# Altium schematic sheet REMOTE-1.SchDoc
size A3; PageSetup: Record=PageOptions|CenterHorizontal=True|CenterVertical=True|PrintScale=1.00|XCorrection=1.00|YCorrection=1.00|PrintKind=1|BorderSize=5000000|LeftOffset=0|BottomOffset=0|Orientation=2|PaperLength=1000|PaperWidth=1000|Scale=100|PaperSource=7|PrintQuality=-4|MediaType=1|DitherType=10|PaperKind=A3|PrintScaleMode=1
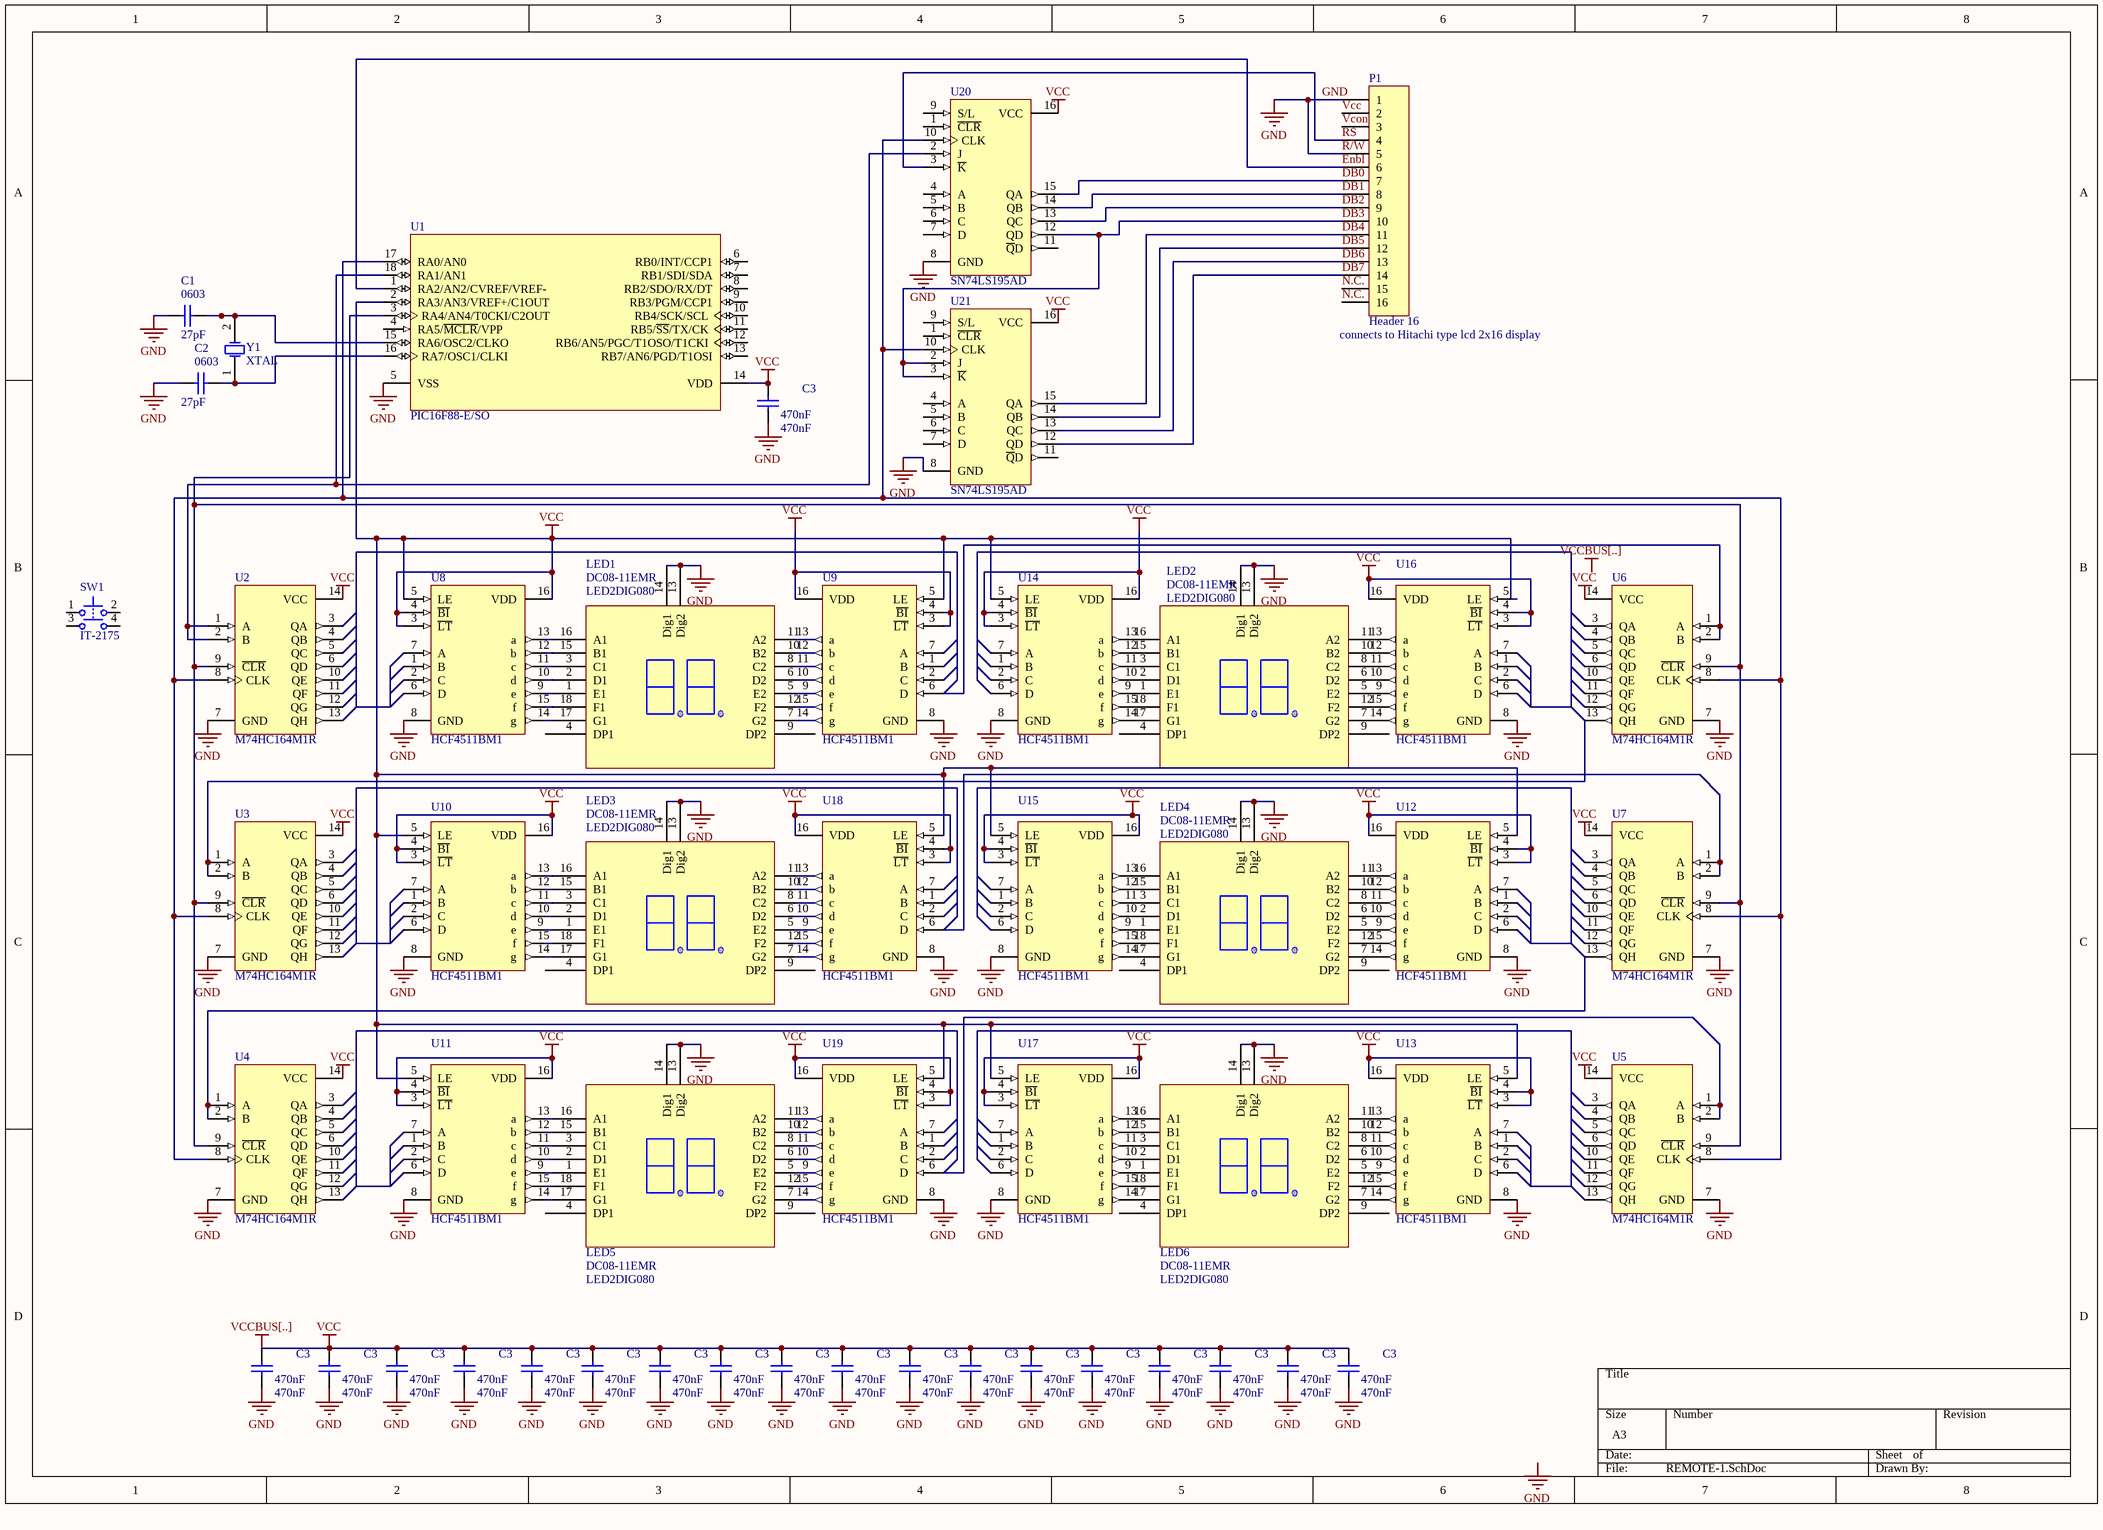
[diagram p0: REMOTE-1.SchDoc]

## Parts
(Parts that share a designator on the sheet are numbered #1, #2 ... from top to bottom, then left to right.)
C1  27pF  [0603]
C2  value 27pF  [0603]  (hidden comment: 0603)
C3#1  470nF  [0603]
C3#2  470nF  [0603]
C3#3  470nF  [0603]
C3#4  470nF  [0603]
C3#5  470nF  [0603]
C3#6  470nF  [0603]
C3#7  470nF  [0603]
C3#8  470nF  [0603]
C3#9  470nF  [0603]
C3#10  470nF  [0603]
C3#11  470nF  [0603]
C3#12  470nF  [0603]
C3#13  470nF  [0603]
C3#14  470nF  [0603]
C3#15  470nF  [0603]
C3#16  470nF  [0603]
C3#17  470nF  [0603]
C3#18  470nF  [0603]
C3#19  470nF  [0603]
LED1  DC08-11EMR  Footprint: LED2DIG080  [LED2DIG-DIP18]
LED2  DC08-11EMR  Footprint: LED2DIG080  [LED2DIG-DIP18]
LED3  DC08-11EMR  Footprint: LED2DIG080  [LED2DIG-DIP18]
LED4  DC08-11EMR  Footprint: LED2DIG080  [LED2DIG-DIP18]
LED5  DC08-11EMR  Footprint: LED2DIG080  [LED2DIG-DIP18]
LED6  DC08-11EMR  Footprint: LED2DIG080  [LED2DIG-DIP18]
P1  Header 16  [HDR1X16]
SW1  IT-2175  [IT-2175]
U1  PIC16F88-E/SO  [SOIC300-18_N]
U2  M74HC164M1R  [SO14_N]
U3  M74HC164M1R  [SO14_N]
U4  M74HC164M1R  [SO14_N]
U5  M74HC164M1R  [SO14_N]
U6  M74HC164M1R  [SO14_N]
U7  M74HC164M1R  [SO14_N]
U8  HCF4511BM1  [SO16_L]
U9  HCF4511BM1  [SO16_L]
U10  HCF4511BM1  [SO16_L]
U11  HCF4511BM1  [SO16_L]
U12  HCF4511BM1  [SO16_L]
U13  HCF4511BM1  [SO16_L]
U14  HCF4511BM1  [SO16_L]
U15  HCF4511BM1  [SO16_L]
U16  HCF4511BM1  [SO16_L]
U17  HCF4511BM1  [SO16_L]
U18  HCF4511BM1  [SO16_L]
U19  HCF4511BM1  [SO16_L]
U20  SN74LS195AD  [D016_L]
U21  SN74LS195AD  [D016_L]
Y1  XTAL  [R38]

## Nets
GND: C1.1 C2.1 C3#1.2 C3#2.2 C3#3.2 C3#4.2 C3#5.2 C3#6.2 C3#7.2 C3#8.2 C3#9.2 C3#10.2 C3#11.2 C3#12.2 C3#13.2 C3#14.2 C3#15.2 C3#16.2 C3#17.2 C3#18.2 C3#19.2 LED1.13(Dig2) LED1.14(Dig1) LED2.13(Dig2) LED2.14(Dig1) LED3.13(Dig2) LED3.14(Dig1) LED4.13(Dig2) LED4.14(Dig1) LED5.13(Dig2) LED5.14(Dig1) LED6.13(Dig2) LED6.14(Dig1) P1.1 P1.5 U1.5(VSS) U2.7(GND) U3.7(GND) U4.7(GND) U5.7(GND) U6.7(GND) U7.7(GND) U8.8(GND) U9.8(GND) U10.8(GND) U11.8(GND) U12.8(GND) U13.8(GND) U14.8(GND) U15.8(GND) U16.8(GND) U17.8(GND) U18.8(GND) U19.8(GND) U20.8(GND) U21.8(GND)  [also labelled R~{/}W]
Vcc: C3#1.1 C3#2.1 C3#3.1 C3#4.1 C3#5.1 C3#6.1 C3#7.1 C3#8.1 C3#9.1 C3#10.1 C3#11.1 C3#12.1 C3#13.1 C3#14.1 C3#15.1 C3#16.1 C3#17.1 C3#18.1 C3#19.1 P1.2 U1.2(RA3/AN3/VREF+/C1OUT) U1.14(VDD) U2.14(VCC) U3.14(VCC) U4.14(VCC) U5.14(VCC) U6.14(VCC) U7.14(VCC) U8.3(~{LT}) U8.4(~{BI}) U8.5(LE) U8.16(VDD) U9.3(~{LT}) U9.4(~{BI}) U9.5(LE) U9.16(VDD) U10.3(~{LT}) U10.4(~{BI}) U10.5(LE) U10.16(VDD) U11.3(~{LT}) U11.4(~{BI}) U11.5(LE) U11.16(VDD) U12.3(~{LT}) U12.4(~{BI}) U12.5(LE) U12.16(VDD) U13.3(~{LT}) U13.4(~{BI}) U13.5(LE) U13.16(VDD) U14.3(~{LT}) U14.4(~{BI}) U14.5(LE) U14.16(VDD) U15.3(~{LT}) U15.4(~{BI}) U15.5(LE) U15.16(VDD) U16.3(~{LT}) U16.4(~{BI}) U16.5(LE) U16.16(VDD) U17.3(~{LT}) U17.4(~{BI}) U17.5(LE) U17.16(VDD) U18.3(~{LT}) U18.4(~{BI}) U18.5(LE) U18.16(VDD) U19.3(~{LT}) U19.4(~{BI}) U19.5(LE) U19.16(VDD) U20.16(VCC) U21.16(VCC)  [also labelled VCCBUS[..]]
DB0: P1.7 U20.15(QA)
DB1: P1.8 U20.14(QB)
DB2: P1.9 U20.13(QC)
DB3: P1.10 U20.12(QD) U21.2(J) U21.3(~{K})
DB4: P1.11 U21.15(QA)
DB5: P1.12 U21.14(QB)
DB6: P1.13 U21.13(QC)
DB7: P1.14 U21.12(QD)
Enbl: P1.6 U1.1(RA2/AN2/CVREF/VREF-)
N.C.: P1.15 P1.16
RS: P1.4 U20.3(~{K})
Vcon: P1.3
NetC1_2: C1.2 U1.15(RA6/OSC2/CLKO) Y1.2(OSC2)
NetC2_2: C2.2 U1.16(RA7/OSC1/CLKI) Y1.1(OSC1)
NetLED1_1: LED1.1(E1) U8.9(e)
NetLED1_2: LED1.2(D1) U8.10(d)
NetLED1_3: LED1.3(C1) U8.11(c)
NetLED1_5: LED1.5(E2) U9.9(e)
NetLED1_6: LED1.6(D2) U9.10(d)
NetLED1_7: LED1.7(G2) U9.14(g)
NetLED1_8: LED1.8(C2) U9.11(c)
NetLED1_10: LED1.10(B2) U9.12(b)
NetLED1_11: LED1.11(A2) U9.13(a)
NetLED1_12: LED1.12(F2) U9.15(f)
NetLED1_15: LED1.15(B1) U8.12(b)
NetLED1_16: LED1.16(A1) U8.13(a)
NetLED1_17: LED1.17(G1) U8.14(g)
NetLED1_18: LED1.18(F1) U8.15(f)
NetLED3_1: LED3.1(E1) U10.9(e)
NetLED3_2: LED3.2(D1) U10.10(d)
NetLED3_3: LED3.3(C1) U10.11(c)
NetLED3_5: LED3.5(E2) U18.9(e)
NetLED3_6: LED3.6(D2) U18.10(d)
NetLED3_7: LED3.7(G2) U18.14(g)
NetLED3_8: LED3.8(C2) U18.11(c)
NetLED3_10: LED3.10(B2) U18.12(b)
NetLED3_11: LED3.11(A2) U18.13(a)
NetLED3_12: LED3.12(F2) U18.15(f)
NetLED3_15: LED3.15(B1) U10.12(b)
NetLED3_16: LED3.16(A1) U10.13(a)
NetLED3_17: LED3.17(G1) U10.14(g)
NetLED3_18: LED3.18(F1) U10.15(f)
NetLED5_1: LED5.1(E1) U11.9(e)
NetLED5_2: LED5.2(D1) U11.10(d)
NetLED5_3: LED5.3(C1) U11.11(c)
NetLED5_5: LED5.5(E2) U19.9(e)
NetLED5_6: LED5.6(D2) U19.10(d)
NetLED5_7: LED5.7(G2) U19.14(g)
NetLED5_8: LED5.8(C2) U19.11(c)
NetLED5_10: LED5.10(B2) U19.12(b)
NetLED5_11: LED5.11(A2) U19.13(a)
NetLED5_12: LED5.12(F2) U19.15(f)
NetLED5_15: LED5.15(B1) U11.12(b)
NetLED5_16: LED5.16(A1) U11.13(a)
NetLED5_17: LED5.17(G1) U11.14(g)
NetLED5_18: LED5.18(F1) U11.15(f)
NetU1_3: U1.3(RA4/AN4/T0CKI/C2OUT) U2.9(~{CLR}) U3.9(~{CLR}) U4.9(~{CLR}) U5.9(~{CLR}) U6.9(~{CLR}) U7.9(~{CLR})
NetU1_17: U1.17(RA0/AN0) U2.8(CLK) U3.8(CLK) U4.8(CLK) U5.8(CLK) U6.8(CLK) U7.8(CLK) U20.10(CLK) U21.10(CLK)
NetU1_18: U1.18(RA1/AN1) U2.1(A) U2.2(B) U20.2(J)
NetU3_1: U3.1(A) U3.2(B) U6.13(QH)
NetU4_1: U4.1(A) U4.2(B) U7.13(QH)
NetU5_1: U5.1(A) U5.2(B) U19.6(D)
NetU6_1: U6.1(A) U6.2(B) U9.6(D)
NetU7_1: U7.1(A) U7.2(B) U18.6(D)

Not connected (* = marked no-connect by the designer): LED1 4(DP1) 9(DP2); LED2 1(E1) 2(D1) 3(C1) 4(DP1) 5(E2) 6(D2) 7(G2) 8(C2) 9(DP2) 10(B2) 11(A2) 12(F2) 15(B1) 16(A1) 17(G1) 18(F1); LED3 4(DP1) 9(DP2); LED4 1(E1) 2(D1) 3(C1) 4(DP1) 5(E2) 6(D2) 7(G2) 8(C2) 9(DP2) 10(B2) 11(A2) 12(F2) 15(B1) 16(A1) 17(G1) 18(F1); LED5 4(DP1) 9(DP2); LED6 1(E1) 2(D1) 3(C1) 4(DP1) 5(E2) 6(D2) 7(G2) 8(C2) 9(DP2) 10(B2) 11(A2) 12(F2) 15(B1) 16(A1) 17(G1) 18(F1); SW1 1 2 3 4; U1 4(RA5/~{MCLR}/VPP) 6(RB0/INT/CCP1) 7(RB1/SDI/SDA) 8(RB2/SDO/RX/DT) 9(RB3/PGM/CCP1) 10(RB4/SCK/SCL) 11(RB5/~{SS}/TX/CK) 12(RB6/AN5/PGC/T1OSO/T1CKI) 13(RB7/AN6/PGD/T1OSI); U2 3(QA) 4(QB) 5(QC) 6(QD) 10(QE) 11(QF) 12(QG) 13(QH); U3 3(QA) 4(QB) 5(QC) 6(QD) 10(QE) 11(QF) 12(QG) 13(QH); U4 3(QA) 4(QB) 5(QC) 6(QD) 10(QE) 11(QF) 12(QG) 13(QH); U5 3(QA) 4(QB) 5(QC) 6(QD) 10(QE) 11(QF) 12(QG) 13(QH); U6 3(QA) 4(QB) 5(QC) 6(QD) 10(QE) 11(QF) 12(QG); U7 3(QA) 4(QB) 5(QC) 6(QD) 10(QE) 11(QF) 12(QG); U8 1(B) 2(C) 6(D) 7(A); U9 1(B) 2(C) 7(A); U10 1(B) 2(C) 6(D) 7(A); U11 1(B) 2(C) 6(D) 7(A); U12 1(B) 2(C) 6(D) 7(A) 9(e) 10(d) 11(c) 12(b) 13(a) 14(g) 15(f); U13 1(B) 2(C) 6(D) 7(A) 9(e) 10(d) 11(c) 12(b) 13(a) 14(g) 15(f); U14 1(B) 2(C) 6(D) 7(A) 9(e) 10(d) 11(c) 12(b) 13(a) 14(g) 15(f); U15 1(B) 2(C) 6(D) 7(A) 9(e) 10(d) 11(c) 12(b) 13(a) 14(g) 15(f); U16 1(B) 2(C) 6(D) 7(A) 9(e) 10(d) 11(c) 12(b) 13(a) 14(g) 15(f); U17 1(B) 2(C) 6(D) 7(A) 9(e) 10(d) 11(c) 12(b) 13(a) 14(g) 15(f); U18 1(B) 2(C) 7(A); U19 1(B) 2(C) 7(A); U20 1(~{CLR}) 4(A) 5(B) 6(C) 7(D) 9(S/L) 11(~{Q}D); U21 1(~{CLR}) 4(A) 5(B) 6(C) 7(D) 9(S/L) 11(~{Q}D)

## Notes on the sheet
- Labels drawn without touching a wire or pin: GND, VCCBUS[..]

## Library data of the parts
C1 C2 C3#1-C3#19 = C0603: Ceramic Chip Capacitor - Standard; Note: Footprint corresponds to dimensions for bulk cassette packaging. This case size has tightened tolerances.; Published: 17-Jul-2002; LatestRevisionDate: 19-Mar-2004; LatestRevisionNote: Silkscreen size reduced.; DatasheetDocument: Mar-2001; PackageDocument: Mar-2001; PackageReference: 0603; Publisher: Altium Limited; Code_JEITA: 0603; Code_IPC: 1608 [0603]; ComponentLink1Description: Manufacturer Link; ComponentLink1URL: http://www.kemet.com/; ComponentLink2Description: Datasheet; ComponentLink2URL: http://www.kemet.com/kemet/web/homepage/kechome.nsf/vapubfilesname/F3102TA.pdf/$file/F3102TA.pdf
  C1: Value: 27pF
  C3#1-C3#19: Value: 470nF
LED1-LED6 = 2DIG-080-R-CC-LED: 2 Digit 1.1 Red CC LED Display; Manufacturer: Kingbright; Description: LED-2DIG Y Display CC; Aardvark Number: TBD; Distributor: Mouser; Distributor Number: DC08-11EMR; Manufacturer Number: DC08-11EMR; Price: 1.82
P1 = Header 16: Header, 16-Pin; LatestRevisionDate: 17-Jul-2002; LatestRevisionNote: Re-released for DXP Platform.; Publisher: Altium Limited
SW1 = IT-2175: Tactile Switch, DPST; Thru-Hole; Vertical; Rating DC 12V, 50mA (max); PackageDocument: Rev.0; Published: 6-Jun-2005; DatasheetDocument: Rev.0; PackageReference: IT-2175; Publisher: Altium Limited; ComponentLink1Description: Manufacturer Link; ComponentLink1URL: http://www.ilswitch.com/; ComponentLink2Description: Device Overview; ComponentLink2URL: http://www.ilswitch.com/list.php?ac_id=010112&ai_id=91
U1 = PIC16F88-E/SO: Enhanced FLASH Microcontroller with nanoWatt Technology, 10-Bit A/D, 4K (x14-Bit words) FLASH, 368 Bytes RAM, 18-Pin SOIC, Standard VDD Range, Extended Temperature; Note: The CCP1 pin is determined by CCPMX in Configuration Word 1 register.; Published: 11-Oct-2004; LatestRevisionDate: 13-Apr-2006; LatestRevisionNote: IPC-7351 Footprint Added.; DatasheetVersion: DS30487B_2003; PackageVersion: 2003; PackageReference: SOIC300-18; Publisher: Altium Limited; PackageDescription: 18-Pin Small Outline Integrated Circuit 1.27 mm Pitch; Code_JEDEC: MS-013; ComponentLink1Description: Manufacturer Link; ComponentLink1URL: http://www.microchip.com; ComponentLink2Description: Datasheet; ComponentLink2URL: http://ww1.microchip.com/downloads/en/DeviceDoc/30487b.pdf; ComponentLink3Description: Packaging Specification; ComponentLink3URL: http://ww1.microchip.com/downloads/en/PackagingSpec/00049AD.pdf
U2-U7 = M74HC164M1R: 8 Bit SIPO Shift Register; Published: 8-Jun-2000; LatestRevisionDate: 13-Apr-2006; LatestRevisionNote: IPC-7351 Footprint Added.; DatasheetVersion: Oct-1992; PackageVersion: Sep-1998; PackageReference: SO14; Publisher: Altium Limited; PackageDescription: 14-Pin Small Outline Integrated Circuit 1.27 mm Pitch; Code_IPC: SOIC127P600-14; ComponentLink1Description: Manufacturer Link; ComponentLink1URL: http://www.st.com/; ComponentLink2Description: Datasheet; ComponentLink2URL: http://www.st.com/stonline/products/literature/ds/1910/m74hc164.pdf
U8-U19 = HCF4511BM1: Liquid-Crystal Display Driver; Published: 8-Jun-2000; LatestRevisionDate: 13-Apr-2006; LatestRevisionNote: IPC-7351 Footprint Added.; DatasheetVersion: Mar-1999; PackageVersion: May-1998; PackageReference: SO16; Publisher: Altium Limited; PackageDescription: 16-Pin Small Outline Integrated Circuit 1.27 mm Pitch; Code_IPC: SOIC127P600-16; ComponentLink1Description: Manufacturer Link; ComponentLink1URL: http://www.st.com/; ComponentLink2Description: Datasheet; ComponentLink2URL: http://www.st.com/stonline/products/literature/ds/4900/hcf4511.pdf
U20 U21 = SN74LS195AD: 4-Bit Parallel-Access Shift Register; ComponentAvailability: Obsolete; Published: 8-Jun-2000; LatestRevisionDate: 13-Apr-2006; LatestRevisionNote: IPC-7351 Footprint Added.; DatasheetVersion: Mar-1988; PackageVersion: Jan-1998; PackageReference: D016; Publisher: Altium Limited; PackageDescription: 16-Pin Small Outline Integrated Circuit 1.27 mm Pitch; Code_IPC: SOIC127P600-16; ComponentLink1Description: Manufacturer Link; ComponentLink1URL: http://www.ti.com/; ComponentLink2Description: Datasheet; ComponentLink2URL: http://www-s.ti.com/sc/ds/sn74ls195a.pdf
Y1 = XTAL: Crystal Oscillator; Published: 8-Jun-2000; LatestRevisionDate: 17-Jul-2002; LatestRevisionNote: Re-released for DXP Platform.; PackageReference: R38; Publisher: Altium Limited